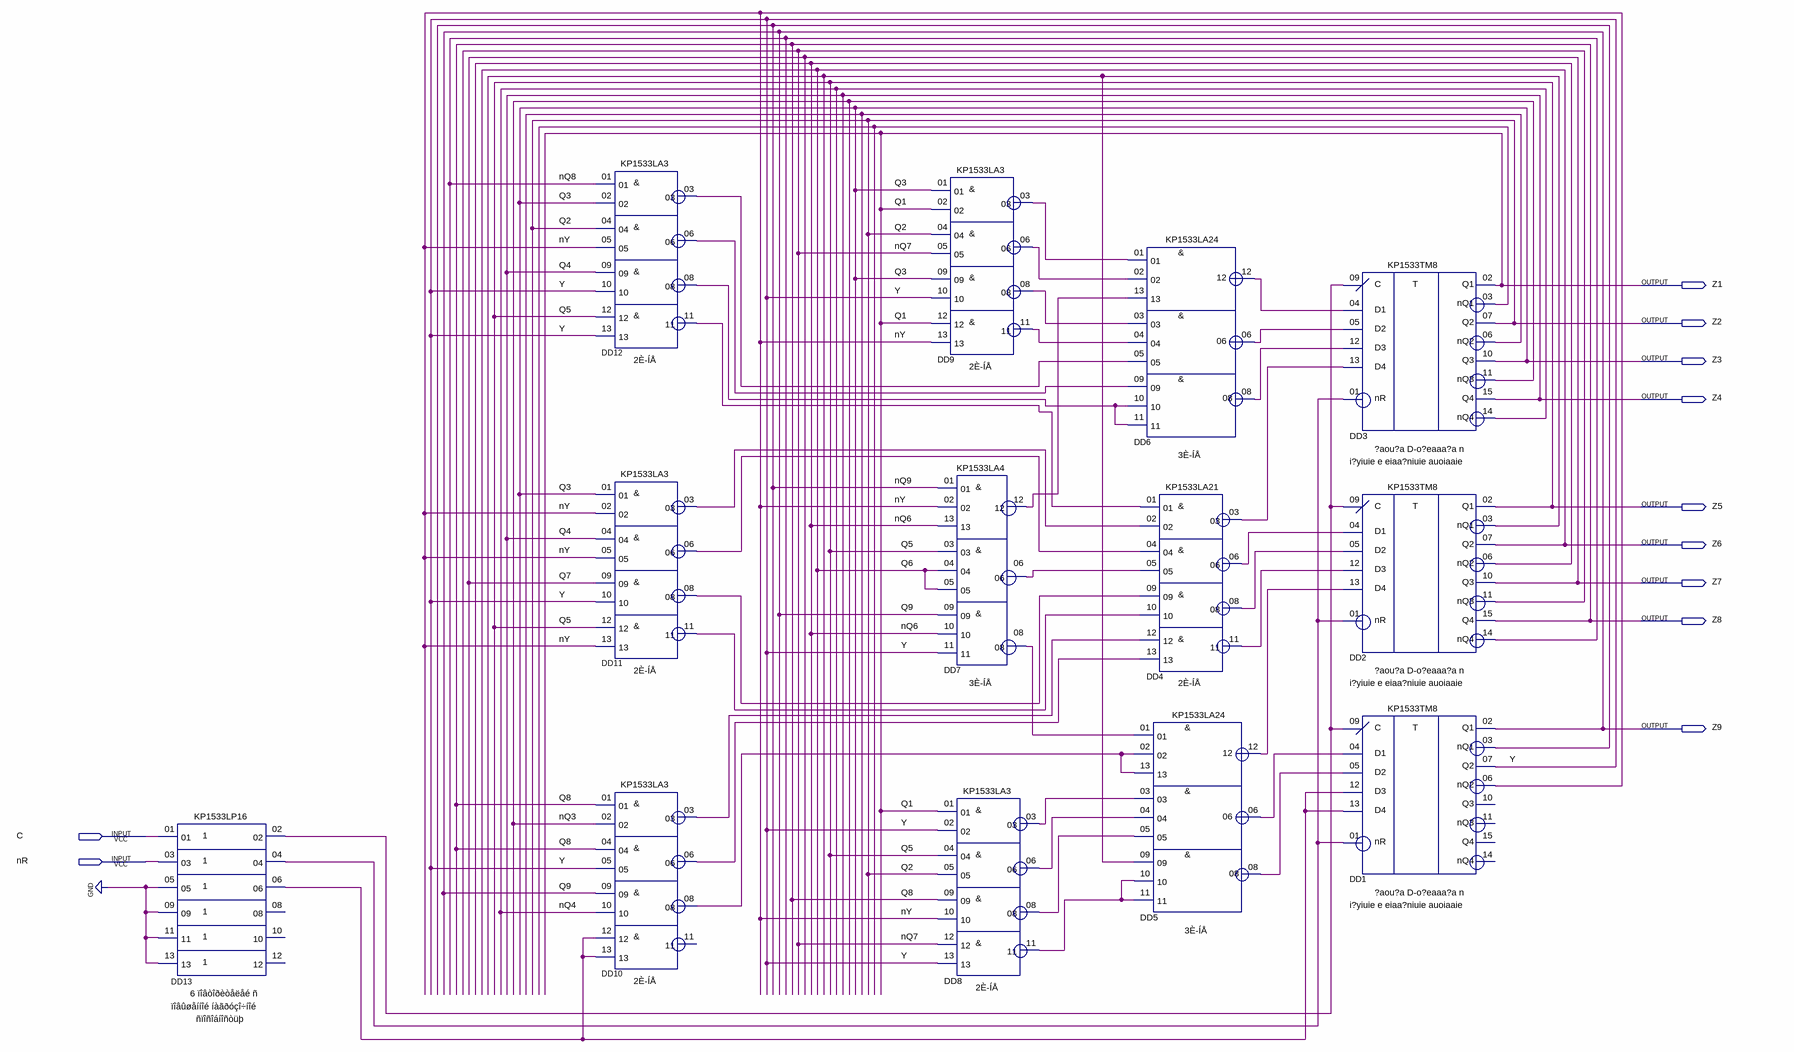
[diagram p0: schematic sheet]
// Quartus schematic _JohnsonCounterDFF.bdf as structural Verilog: 13 symbols, 11 pins
module _JohnsonCounterDFF (
  input  C,
  input  nR,
  output Z1,
  output Z2,
  output Z3,
  output Z4,
  output Z5,
  output Z6,
  output Z7,
  output Z8,
  output Z9
);

  wire DD2_nq1, DD3_nq1, DD3_nq2, DD4_03, DD4_06, DD4_08, DD4_11, DD5_06, DD5_08, DD5_12, DD6_06, DD6_08,
       DD6_12, DD7_06, DD7_08, DD7_12, DD8_03, DD8_06, DD8_08, DD8_11, DD9_03, DD9_06, DD9_08, DD9_11,
       DD10_03, DD10_06, DD10_08, DD11_03, DD11_06, DD11_08, DD11_11, DD12_03, DD12_06, DD12_08, DD12_11,
       DD13_02, DD13_04, DD13_06, nQ3, nQ4, nQ6, nQ7, nQ8, nQ9, nY, Y;

  KP1533LP16 DD13 (
    .\01 (C), .\03 (nR), .\05 (1'b0), .\09 (1'b0), .\11 (1'b0), .\13 (1'b0), .\02 (DD13_02), .\04 (DD13_04),
    .\06 (DD13_06));  // open: 08, 10, 12
  KP1533LA3 DD12 (
    .\01 (nQ8), .\02 (Z3), .\04 (Z2), .\05 (nY), .\09 (Z4), .\10 (Y), .\12 (Z5), .\13 (Y), .\03 (DD12_03),
    .\06 (DD12_06), .\08 (DD12_08), .\11 (DD12_11));
  KP1533LA3 DD11 (
    .\01 (Z3), .\02 (nY), .\04 (Z4), .\05 (nY), .\09 (Z7), .\10 (Y), .\12 (Z5), .\13 (nY), .\03 (DD11_03),
    .\06 (DD11_06), .\08 (DD11_08), .\11 (DD11_11));
  KP1533LA3 DD10 (
    .\01 (Z8), .\02 (nQ3), .\04 (Z8), .\05 (Y), .\09 (Z9), .\10 (nQ4), .\12 (DD13_06), .\13 (DD13_06),
    .\03 (DD10_03), .\06 (DD10_06), .\08 (DD10_08));  // open: 11
  KP1533LA3 DD9 (
    .\01 (Z3), .\02 (Z1), .\04 (Z2), .\05 (nQ7), .\09 (Z3), .\10 (Y), .\12 (Z1), .\13 (nY), .\03 (DD9_03),
    .\06 (DD9_06), .\08 (DD9_08), .\11 (DD9_11));
  KP1533LA4 DD7 (
    .\01 (nQ9), .\02 (nY), .\13 (nQ6), .\03 (Z5), .\04 (Z6), .\05 (Z6), .\09 (Z9), .\10 (nQ6), .\11 (Y),
    .\12 (DD7_12), .\06 (DD7_06), .\08 (DD7_08));
  KP1533LA3 DD8 (
    .\01 (Z1), .\02 (Y), .\04 (Z5), .\05 (Z2), .\09 (Z8), .\10 (nY), .\12 (nQ7), .\13 (Y), .\03 (DD8_03),
    .\06 (DD8_06), .\08 (DD8_08), .\11 (DD8_11));
  KP1533LA24 DD6 (
    .\01 (DD9_03), .\02 (DD9_06), .\13 (DD7_12), .\03 (DD9_08), .\04 (DD9_11), .\05 (DD12_03),
    .\09 (DD12_06), .\10 (DD12_08), .\11 (DD12_08), .\12 (DD6_12), .\06 (DD6_06), .\08 (DD6_08));
  KP1533LA21 DD4 (
    .\01 (DD12_11), .\02 (DD11_03), .\04 (DD11_06), .\05 (DD7_06), .\09 (DD11_08), .\10 (DD11_11),
    .\12 (DD10_03), .\13 (DD10_06), .\03 (DD4_03), .\06 (DD4_06), .\08 (DD4_08), .\11 (DD4_11));
  KP1533LA24 DD5 (
    .\01 (DD7_08), .\02 (DD10_08), .\13 (DD10_08), .\03 (DD8_03), .\04 (DD8_06), .\05 (DD8_08),
    .\09 (DD2_nq1), .\10 (DD8_11), .\11 (DD8_11), .\12 (DD5_12), .\06 (DD5_06), .\08 (DD5_08));
  KP1533TM8 DD3 (
    .nR(DD13_04), .C(DD13_02), .D1(DD6_12), .D2(DD6_06), .D3(DD6_08), .D4(DD4_03), .Q1(Z1), .nQ1(DD3_nq1),
    .Q2(Z2), .nQ2(DD3_nq2), .Q3(Z3), .nQ3(nQ3), .Q4(Z4), .nQ4(nQ4));
  KP1533TM8 DD2 (
    .nR(DD13_04), .C(DD13_02), .D1(DD4_06), .D2(DD4_08), .D3(DD4_11), .D4(DD5_12), .Q1(Z5), .nQ1(DD2_nq1),
    .Q2(Z6), .nQ2(nQ6), .Q3(Z7), .nQ3(nQ7), .Q4(Z8), .nQ4(nQ8));
  KP1533TM8 DD1 (
    .nR(DD13_04), .C(DD13_02), .D1(DD5_06), .D2(DD5_08), .D3(DD13_06), .D4(DD13_06), .Q1(Z9), .nQ1(nQ9),
    .Q2(Y), .nQ2(nY));  // open: Q3, nQ3, Q4, nQ4

  // Other names for the same wires on the sheet: Q4 = Z4; Q7 = Z7; Q1 = Z1; Q2 = Z2; Q3 = Z3; Q5 = Z5; Q6 = Z6;
  //   Q8 = Z8; Q9 = Z9
endmodule
